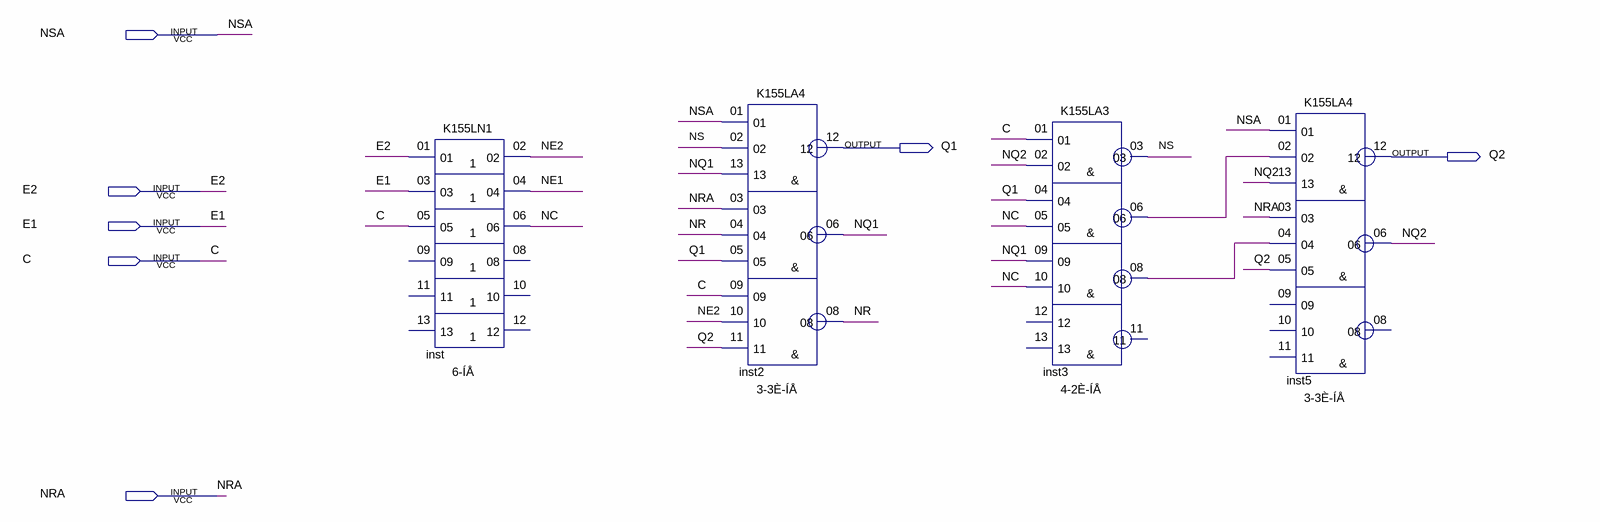
[diagram p0: schematic sheet]
// Quartus schematic scheme1.bdf as structural Verilog: 4 symbols, 7 pins
module scheme1 (
  input  NSA,
  input  E2,
  input  E1,
  input  C,
  input  NRA,
  output Q1,
  output Q2
);

  wire inst3_06, inst3_08, NC, NE1, NE2, NQ1, NQ2, NR, NS;

  K155LN1 inst (.\01 (E2), .\03 (E1), .\05 (C), .\02 (NE2), .\04 (NE1), .\06 (NC));  // open: 09, 11, 13, 08, 10, 12
  K155LA4 inst2 (
    .\01 (NSA), .\02 (NS), .\13 (NQ1), .\03 (NRA), .\04 (NR), .\05 (Q1), .\09 (C), .\10 (NE2), .\11 (Q2),
    .\12 (Q1), .\06 (NQ1), .\08 (NR));
  K155LA3 inst3 (
    .\01 (C), .\02 (NQ2), .\04 (Q1), .\05 (NC), .\09 (NQ1), .\10 (NC), .\03 (NS), .\06 (inst3_06),
    .\08 (inst3_08));  // open: 12, 13, 11
  K155LA4 inst5 (
    .\01 (NSA), .\02 (inst3_06), .\13 (NQ2), .\03 (NRA), .\04 (inst3_08), .\05 (Q2), .\12 (Q2), .\06 (NQ2));  // open: 09, 10, 11, 08
endmodule
